# EAGLE schematic DualEncoderBoard-revc (EAGLE 8.2.1)
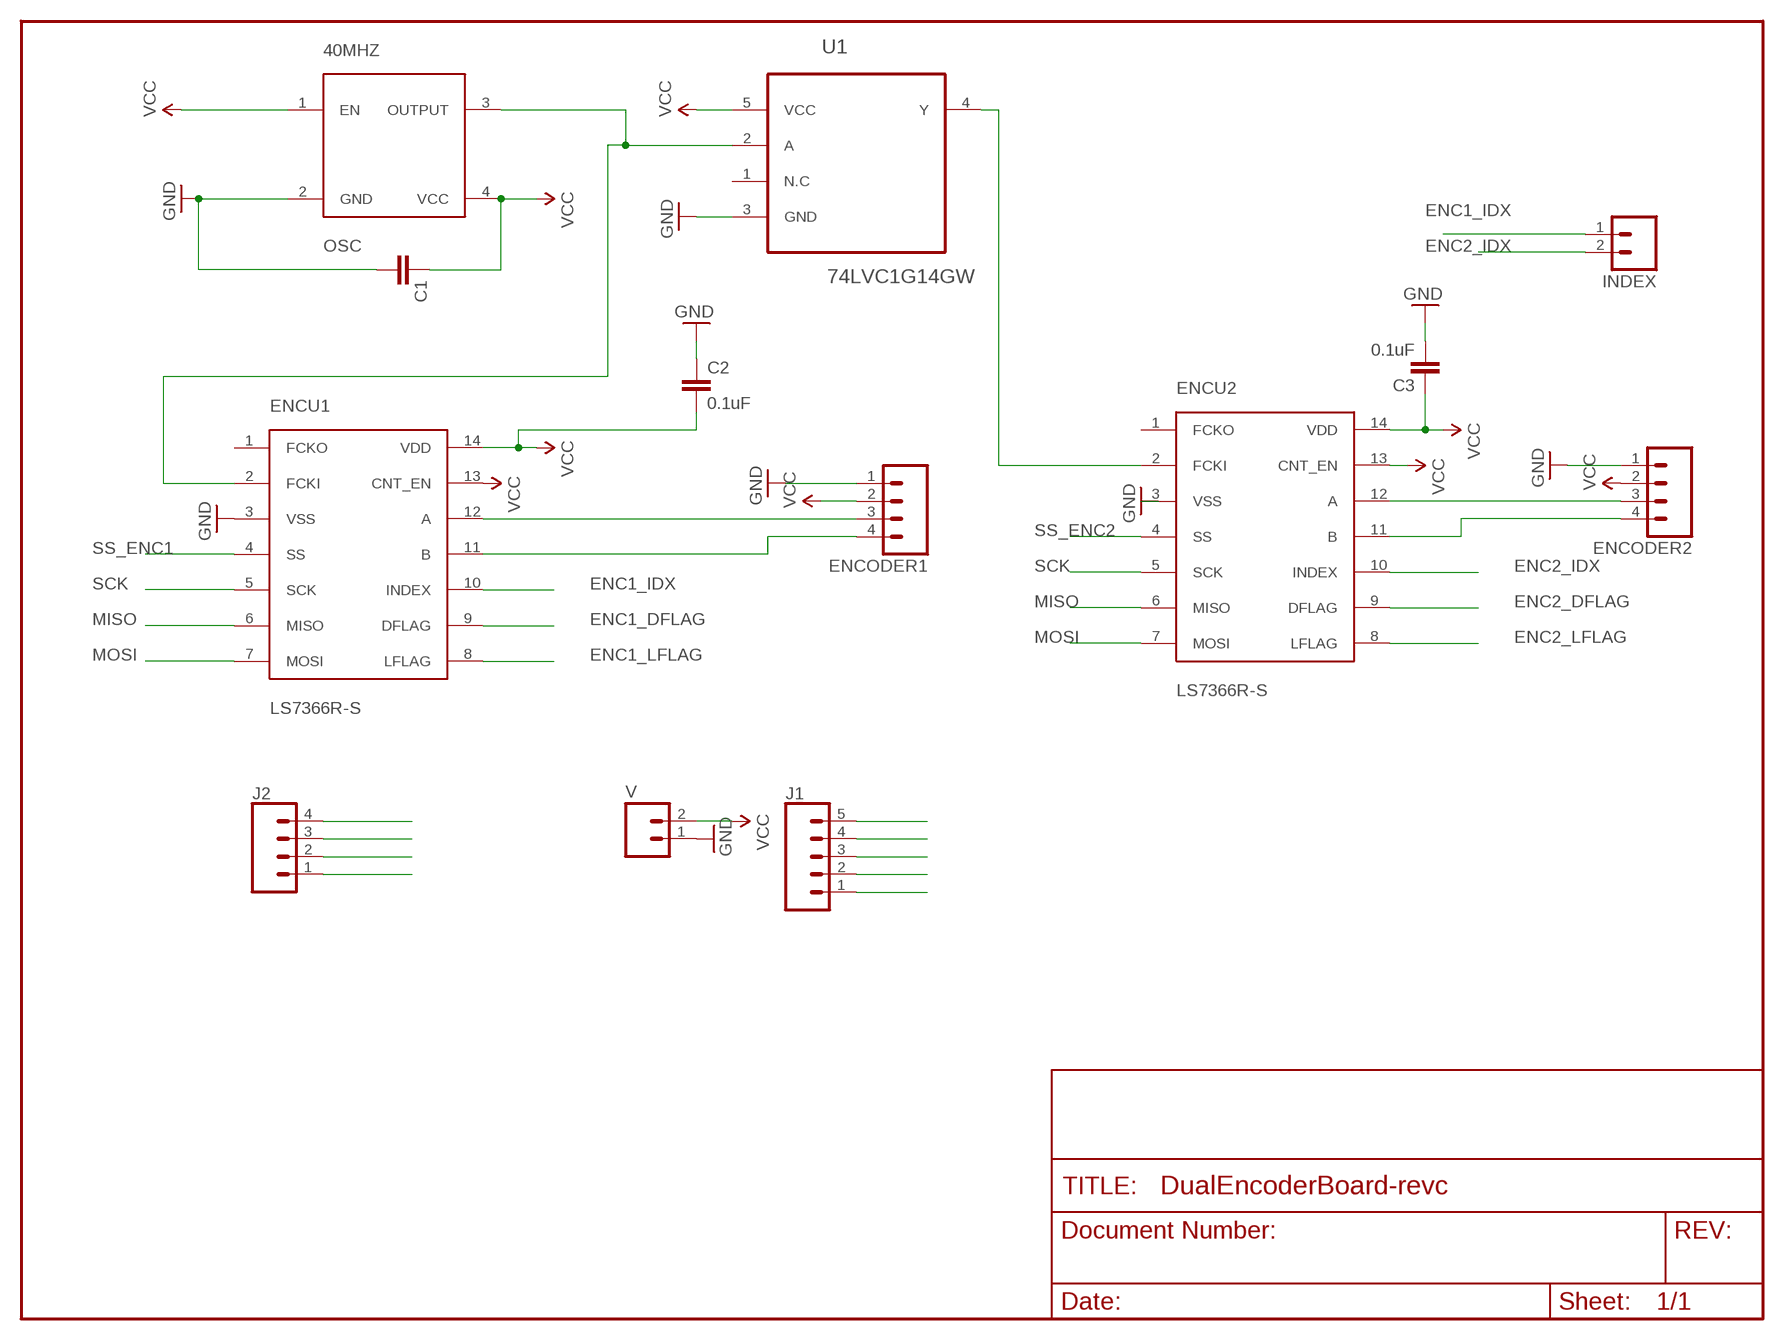
[diagram p0: schematic, sheet 1]

## Parts
40MHZ  OSC  [CB3OSCILLATOR]
C1  CAPKIT  [CAP-PTH-SMALL-KIT]
C2  0.1uF  0.1UF-0603-25V-5%  [0603]
C3  0.1uF  0.1UF-0603-25V-5%  [0603]
ENCODER1  M04POLAR  [MOLEX-1X4]
ENCODER2  M04POLAR  [MOLEX-1X4]
ENCU1  LS7366R-S  [SO14]
ENCU2  LS7366R-S  [SO14]
INDEX  M02PTH  [1X02]
J1  CONN_05  [1X05]
J2  CONN_04  [1X04]
U1  74LVC1G14GW  [SOT65P210X110-5N]
V  M02-JST-2MM-SMT  [JST-2-SMD]

## Nets
ENC1_DFLAG: ENCU1.9(DFLAG) J2.4
ENC1_IDX: ENCU1.10(INDEX) INDEX.1
ENC1_LFLAG: ENCU1.8(LFLAG) J2.3
ENC2_DFLAG: ENCU2.9(DFLAG) J2.2
ENC2_IDX: ENCU2.10(INDEX) INDEX.2
ENC2_LFLAG: ENCU2.8(LFLAG) J2.1
GND: 40MHZ.2(GND) C1.2 C2.1 C3.2 ENCODER1.1 ENCODER2.1 ENCU1.3(VSS) ENCU2.3(VSS) U1.3(GND) V.1
MISO: ENCU1.6(MISO) ENCU2.6(MISO) J1.2
MOSI: ENCU1.7(MOSI) ENCU2.7(MOSI) J1.1
N$1: ENCODER1.3 ENCU1.12(A)
N$2: ENCODER1.4 ENCU1.11(B)
N$3: ENCODER2.3 ENCU2.12(A)
N$4: ENCODER2.4 ENCU2.11(B)
N$5: ENCU2.2(FCKI) U1.4(Y)
N$7: 40MHZ.3(OUTPUT) ENCU1.2(FCKI) U1.2(A)
SCK: ENCU1.5(SCK) ENCU2.5(SCK) J1.3
SS_ENC1: ENCU1.4(SS) J1.5
SS_ENC2: ENCU2.4(SS) J1.4
VCC: 40MHZ.1(EN) 40MHZ.4(VCC) C1.1 C2.2 C3.1 ENCODER1.2 ENCODER2.2 ENCU1.13(CNT_EN) ENCU1.14(VDD) ENCU2.13(CNT_EN) ENCU2.14(VDD) U1.5(VCC) V.2
Unconnected: ENCU1.1(FCKO) ENCU2.1(FCKO) U1.1(N.C)

## Library data of the parts
40MHZ = steveo:OSC: CB3 40mhz Oscillator smd
C1 = SparkFun:CAP: Capacitor Standard 0603 ceramic capacitor, and 0.1" leaded capacitor.
C2 C3 = SparkFun-Capacitors:0.1UF: 0.1µF ceramic capacitors A capacitor is a passive two-terminal electrical component used to store electrical energy temporarily in an electric field.; PROD_ID: CAP-08604
ENCODER1 ENCODER2 = SparkFun:M04: Header 4 Standard 4-pin 0.1" header. Use with straight break away headers (SKU : PRT-00116), right angle break away headers (PRT-00553), swiss pins (PRT-00743), machine pins (PRT-00117), and female headers (PRT-00115). Molex polarized connector foot print use with SKU : PRT-08231 with associated crimp pins and housings. 1MM SMD Version SKU: PRT-10208
ENCU1 ENCU2 = steveo:LS7366R-S
INDEX V = SparkFun:M02: Header 2 Standard 2-pin 0.1" header. Use with straight break away headers (SKU : PRT-00116), right angle break away headers (PRT-00553), swiss pins (PRT-00743), machine pins (PRT-00117), and female headers (PRT-00115). Molex polarized connector foot print use with SKU : PRT-08233 with associated crimp pins and housings.
J1 = SparkFun-Connectors:CONN_05: Multi connection point. Often used as Generic Header-pin footprint for 0.1 inch spaced/style header connections On any of the 0.1 inch spaced packages, you can populate with these: Break Away Headers - Straight <https://www.sparkfun.com/products/116> (PRT-00116) Break Away Male Headers - Right Angle <https://www.sparkfun.com/products/553> (PRT-00553) Female Headers <https://www.sparkfun.com/products/115> (PRT-00115) Break Away Headers - Machine Pin <https://www.sparkfun.com/products/117> (PRT-00117) Break Away Female Headers - Swiss Machine Pin <https://www.sparkfun.com/products/743> (PRT-00743) For SCREWTERMINALS and SPRING TERMINALS visit here: Screw Terimnals on SparkFun.com <https://www.sparkfun.com/search/results?term=Screw+Terminals> (5mm/3.5mm/2.54mm spacing) This device is also useful as a general connection point to wire up your design to another part of your project. Our various solder wires solder well into these plated through hole pads. Hook-Up Wire - Assortment (Stranded, 22 AWG) <https://www.sparkfun.com/products/11375> (PRT-11375) Hook-Up Wire - Assortment (Solid Core, 22 AWG) <https://www.sparkfun.com/products/11367> (PRT-11367) View the entire wire category on our website here <https://www.sparkfun.com/categories/141> Special notes: Molex polarized connector foot print use with SKU : PRT-08231 with associated crimp pins and housings. 1MM SMD Version SKU: PRT-10208
J2 = SparkFun-Connectors:CONN_04: Multi connection point. Often used as Generic Header-pin footprint for 0.1 inch spaced/style header connections On any of the 0.1 inch spaced packages, you can populate with these: Break Away Headers - Straight <https://www.sparkfun.com/products/116> (PRT-00116) Break Away Male Headers - Right Angle <https://www.sparkfun.com/products/553> (PRT-00553) Female Headers <https://www.sparkfun.com/products/115> (PRT-00115) Break Away Headers - Machine Pin <https://www.sparkfun.com/products/117> (PRT-00117) Break Away Female Headers - Swiss Machine Pin <https://www.sparkfun.com/products/743> (PRT-00743) For SCREWTERMINALS and SPRING TERMINALS visit here: Screw Terimnals on SparkFun.com <https://www.sparkfun.com/search/results?term=Screw+Terminals> (5mm/3.5mm/2.54mm spacing) This device is also useful as a general connection point to wire up your design to another part of your project. Our various solder wires solder well into these plated through hole pads. Hook-Up Wire - Assortment (Stranded, 22 AWG) <https://www.sparkfun.com/products/11375> (PRT-11375) Hook-Up Wire - Assortment (Solid Core, 22 AWG) <https://www.sparkfun.com/products/11367> (PRT-11367) View the entire wire category on our website here <https://www.sparkfun.com/categories/141> Special notes: Molex polarized connector foot print use with SKU : PRT-08231 with associated crimp pins and housings. 1MM SMD Version SKU: PRT-10208; PROD_ID: CONN-09696
U1 = 74LVC1G14GW:74LVC1G14GW: Single Schmitt-trigger inverter; AVAILABILITY: Unavailable; DESCRIPTION: IC MOS 74LVC1G14/SO/74LVC1G14GW PHILIPS RoHS LVC SOt23; MF: NXP Semiconductors; MP: 74LVC1G14GW; PACKAGE: TSSOP-5 NXP Semiconductors; PRICE: 214.47 USD